# EAGLE schematic driverLED (EAGLE 6.5.0)
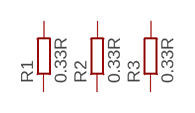
[diagram p0: schematic, sheet 1]

## Parts
R1  0.33R  R-EU_R1206  [R1206]
R2  0.33R  R-EU_R1206  [R1206]
R3  0.33R  R-EU_R1206  [R1206]
Unconnected: R1.1 R1.2 R2.1 R2.2 R3.1 R3.2

## Library data of the parts
R1-R3 = resistor:R-EU_: RESISTOR, European symbol